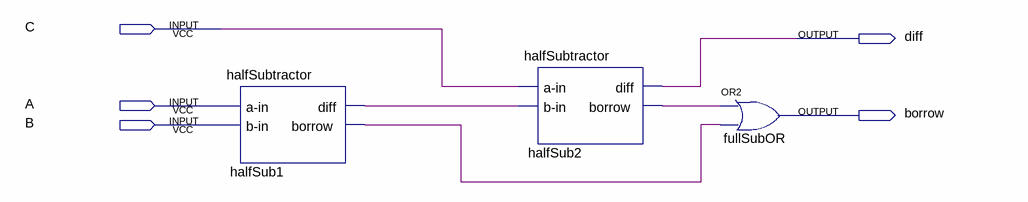
[diagram p0: schematic sheet]
// Quartus schematic fullSubtractor.bdf as structural Verilog: 3 symbols, 5 pins
module fullSubtractor (
  input  C,
  input  A,
  input  B,
  output diff,
  output borrow
);

  wire halfSub1_borrow, halfSub1_diff, halfSub2_borrow;

  halfSubtractor halfSub1 (.\a-in (A), .\b-in (B), .diff(halfSub1_diff), .borrow(halfSub1_borrow));
  halfSubtractor halfSub2 (.\a-in (C), .\b-in (halfSub1_diff), .diff(diff), .borrow(halfSub2_borrow));
  or fullSubOR (borrow, halfSub2_borrow, halfSub1_borrow);
endmodule
